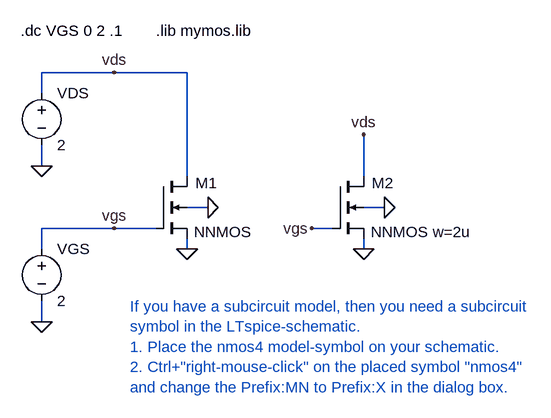
[diagram p0: schematic nnmos_dc_sweep.asc]
nnmos_dc_sweep.asc, the LTspice schematic file:
Version 4
SHEET 1 1204 3300
WIRE 400 -208 288 -208
WIRE 512 -208 400 -208
WIRE 288 -176 288 -208
WIRE 288 -64 288 -96
WIRE 512 -48 512 -208
WIRE 784 -48 784 -112
WIRE 544 0 512 0
WIRE 816 0 784 0
WIRE 400 32 288 32
WIRE 464 32 400 32
WIRE 736 32 704 32
WIRE 288 64 288 32
WIRE 512 64 512 48
WIRE 784 64 784 48
WIRE 288 176 288 144
FLAG 544 0 0
FLAG 512 64 0
FLAG 288 176 0
FLAG 288 -64 0
FLAG 816 0 0
FLAG 784 64 0
FLAG 400 32 vgs
FLAG 704 32 vgs
FLAG 400 -208 vds
FLAG 784 -112 vds
SYMBOL nmos4 464 -48 R0
WINDOW 0 61 10 Left 0
WINDOW 3 59 86 Left 0
SYMATTR InstName M1
SYMATTR Value NNMOS
SYMATTR Prefix X
SYMBOL voltage 288 -192 R0
SYMATTR InstName VDS
SYMATTR Value 2
SYMBOL voltage 288 48 R0
SYMATTR InstName VGS
SYMATTR Value 2
SYMBOL nmos4 736 -48 R0
WINDOW 0 61 10 Left 0
WINDOW 3 59 86 Left 0
SYMATTR InstName M2
SYMATTR Value NNMOS w=2u
SYMATTR Prefix X
TEXT 256 -272 Left 0 !.dc VGS 0 2 .1
TEXT 464 -272 Left 0 !.lib mymos.lib
TEXT 424 152 Left 0 ;If you have a subcircuit model, then you need a subcircuit\nsymbol in the LTspice-schematic.\n1. Place the nmos4 model-symbol on your schematic.\n2. Ctrl+"right-mouse-click" on the placed symbol "nmos4"\nand change the Prefix:MN to Prefix:X in the dialog box.

The netlist it stands for:
* nnmos_dc_sweep.asc
XM1 vds vgs 0 0 NNMOS  ; pins D G S B
VDS vds 0 2
VGS vgs 0 2
XM2 vds vgs 0 0 NNMOS w=2u  ; pins D G S B
.dc VGS 0 2 .1
.lib mymos.lib
* If you have a subcircuit model, then you need a subcircuit
* symbol in the LTspice-schematic.
* 1. Place the nmos4 model-symbol on your schematic.
* 2. Ctrl+"right-mouse-click" on the placed symbol "nmos4"
* and change the Prefix:MN to Prefix:X in the dialog box.
.backanno
.end